# EAGLE design dataBoard (EAGLE 9.4.2)
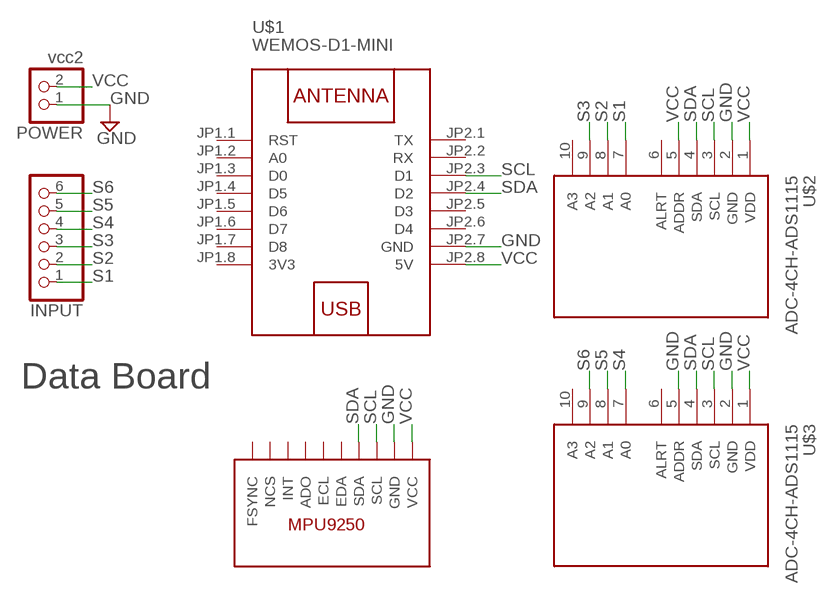
[diagram p0: schematic, sheet 1]

## Parts
INPUT  PINHD-1X6  [1X06]
MPU1  MPU9250  [MPU9250]
POWER  vcc2  PINHD-1X2  [1X02]
U$1  WEMOS-D1-MINI  [WEMOS-D1-MINI]
U$2  ADC-4CH-ADS1115  [ADC-4CH-ADS1115]
U$3  ADC-4CH-ADS1115  [ADC-4CH-ADS1115]

## Nets
GND: MPU1.GND POWER.1 U$1.JP2.7(GND) U$2.2(GND) U$3.2(GND) U$3.5(ADDR)
S1: INPUT.1 U$2.7(A0)
S2: INPUT.2 U$2.8(A1)
S3: INPUT.3 U$2.9(A2)
S4: INPUT.4 U$3.7(A0)
S5: INPUT.5 U$3.8(A1)
S6: INPUT.6 U$3.9(A2)
SCL: MPU1.SCL U$1.JP2.3(D1) U$2.3(SCL) U$3.3(SCL)
SDA: MPU1.SDA U$1.JP2.4(D2) U$2.4(SDA) U$3.4(SDA)
VCC: MPU1.VCC POWER.2 U$1.JP2.8(5V) U$2.1(VDD) U$2.5(ADDR) U$3.1(VDD)
Unconnected: MPU1.ADO MPU1.ECL MPU1.EDA MPU1.FSYNC MPU1.INT MPU1.NCS U$1.JP1.1(RST) U$1.JP1.2(A0) U$1.JP1.3(D0) U$1.JP1.4(D5) U$1.JP1.5(D6) U$1.JP1.6(D7) U$1.JP1.7(D8) U$1.JP2.1(TX) U$1.JP2.2(RX) U$1.JP2.5(D3) U$1.JP2.6(D4) U$2.6(ALRT) U$2.10(A3) U$3.6(ALRT) U$3.10(A3)

## Notes on the sheet
- Data Board

## Power pins joined to a net without a drawn wire
3V3: U$1.JP1.8(3V3)

## Library data of the parts
INPUT = pinhead:PINHD-1X6: PIN HEADER
MPU1 = shoe:MPU9250
POWER = pinhead:PINHD-1X2: PIN HEADER
U$1 = diy-modules:WEMOS-D1-MINI: WEMOS D1 mini: Mini Wi-Fi Board based on ESP-8266 device More details can be found here: https://www.wemos.cc/product/d1-mini.html Click here to find device on ebay.com <http://www.ebay.com/sch/wemos+d1+mini+nodemcu>
U$2 U$3 = diy-modules_me:ADC-4CH-ADS1115: 4 Channel 16-Bit Analog-to-Digital Converter based on ADS1115 chip Arduino ADS1115 Getting Started Tutorial is available here: http://henrysbench.capnfatz.com/henrys-bench/arduino-voltage-measurements/arduino-ads1115-module-getting-started-tutorial/ ADS1115 datasheet is available here: http://www.ti.com/lit/ds/symlink/ads1115.pdf Click here to find device on ebay.com <http://www.ebay.com/sch/ads1115+module>

## Board
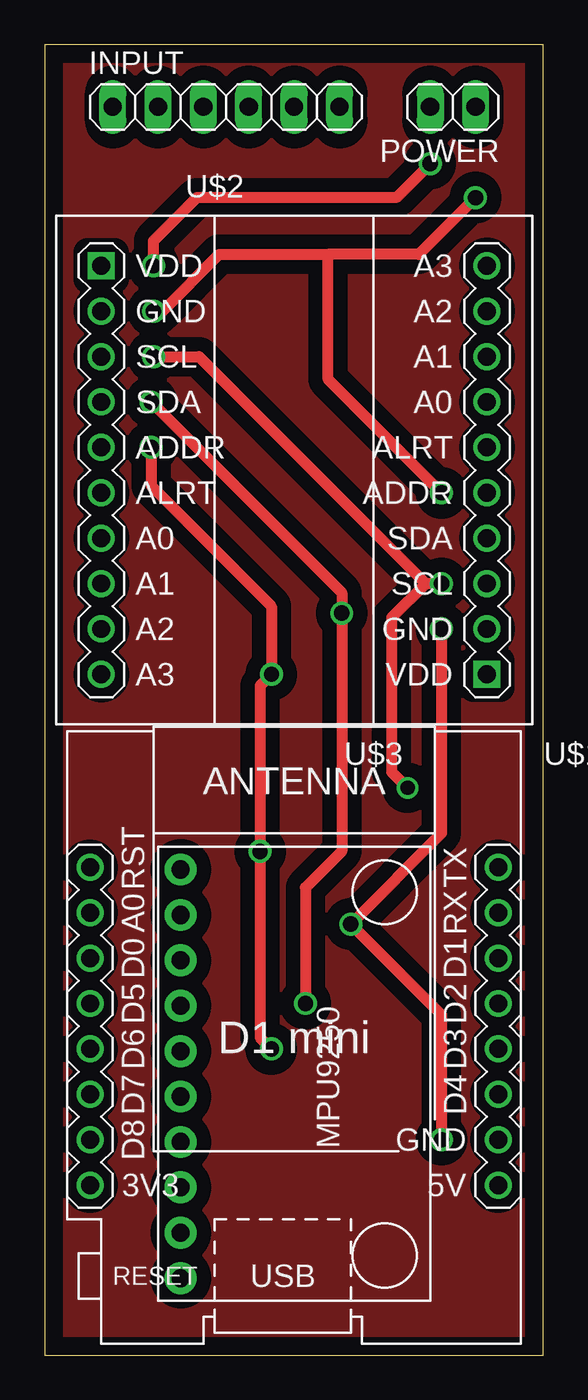
[diagram p1: board, top side]
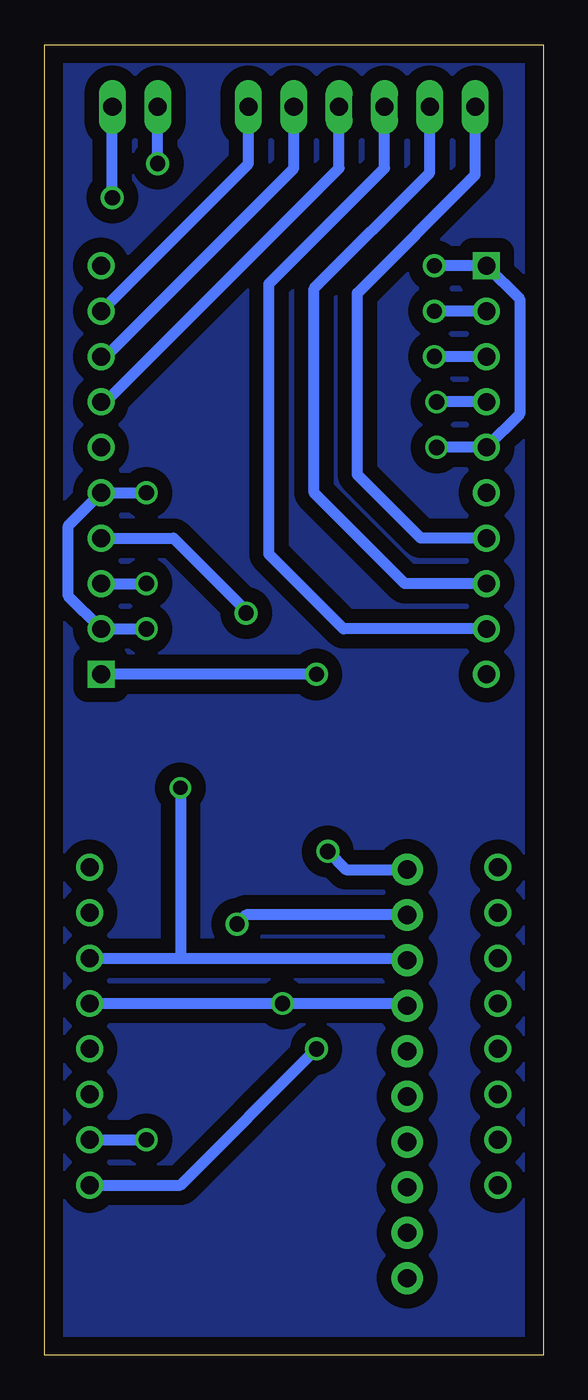
[diagram p2: board, bottom side, seen from below]

Size 27.92 x 73.33 mm. Coordinates in mm from the lower left corner, seen from the top.
Outline: 0,0 27.92,0 27.92,73.33 0,73.33 0,0
Copper layers (1*16): Top 0.035mm / dielectric 1.5mm / Bottom 0.035mm
Design rules "default": minimum track width 6mil, minimum drill 0.35mm, track to track 6mil, track to pad 6mil, pad to pad 6mil, via to via 6mil, smd to smd 6mil, copper to edge 40mil, drill to drill 6mil, minimum pad ring 10mil, minimum via ring 8mil, stop-mask expansion 4mil, vias tented up to drill 0mil, thermal gap 10mil

### Footprints (pad centres in the part's own frame; a part is rotated, then mirrored left to right if it is on the bottom)
1X06 = drill 1.016 long: 1 -6.35,0; 2 -3.81,0; 3 -1.27,0; 4 1.27,0; 5 3.81,0; 6 6.35,0
MPU9250 = drill 1.016 pad 1.778: ADO 3.81,-6.35; ECL 1.27,-6.35; EDA -1.27,-6.35; FSYNC 11.43,-6.35; GND -8.89,-6.35; INT 6.35,-6.35; NCS 8.89,-6.35; SCL -6.35,-6.35; SDA -3.81,-6.35; VCC -11.43,-6.35
1X02 = drill 1.016 long: 1 -1.27,0; 2 1.27,0
WEMOS-D1-MINI = drill 1: JP1.1 -11.43,9.525; JP1.2 -11.43,6.985; JP1.3 -11.43,4.445; JP1.4 -11.43,1.905; JP1.5 -11.43,-0.635; JP1.6 -11.43,-3.175; JP1.7 -11.43,-5.715; JP1.8 -11.43,-8.255; JP2.1 11.43,9.525; JP2.2 11.43,6.985; JP2.3 11.43,4.445; JP2.4 11.43,1.905; JP2.5 11.43,-0.635; JP2.6 11.43,-3.175; JP2.7 11.43,-5.715; JP2.8 11.43,-8.255
ADC-4CH-ADS1115 = drill 1 square: 1 -6.35,11.43 | drill 1: 2 -6.35,8.89; 3 -6.35,6.35; 4 -6.35,3.81; 5 -6.35,1.27; 6 -6.35,-1.27; 7 -6.35,-3.81; 8 -6.35,-6.35; 9 -6.35,-8.89; 10 -6.35,-11.43

### Placement (x,y rotation side)
INPUT  10.16,69.85 0 top
MPU1  13.97,15.75 270 top
POWER  22.86,69.85 180 top
U$1  13.97,17.78 0 top
U$2  9.53,49.53 0 top
U$3  18.41,49.53 180 top

### Tracks (layer width: path | path; a pad name or v marks a point on that pad's centre or on a via)
BOT
  pour Bottom (isolate 0.8): 0,73.28 27.94,73.28 27.94,0 0,0
GND  (via drill 0.85)
  Top 0.61: v22.23,12.06 22.23,19.05 v17.14,24.13 22.23,29.21 v22.23,40.64 | v6.1,58.42 6.6,58.42 9.78,61.59 15.88,61.59 | v24.13,64.77 20.95,61.59 15.88,61.59 | v22.23,48.26 15.88,54.61 15.88,61.59
  Bottom 0.61: U$1.JP2.7 v22.23,12.06 | MPU1.GND 16.64,24.64 v17.14,24.13 | v22.23,40.64 U$3.2 26.6,42.47 26.6,46.43 U$3.5 v22.23,48.26 | U$2.2 v6.1,58.42 | v24.13,64.77 POWER.1
S1
  Bottom 0.61: U$2.7 6.86,45.72 10.41,49.28 10.41,59.44 3.81,66.04 INPUT.1
S2
  Bottom 0.61: U$2.8 7.75,43.18 12.83,48.26 12.83,59.69 6.35,66.17 INPUT.2
S3
  Bottom 0.61: U$2.9 11.18,40.64 15.37,44.83 15.37,59.94 8.89,66.42 INPUT.3
S4
  Bottom 0.61: U$3.7 24.51,53.34 11.43,66.42 INPUT.4
S5
  Bottom 0.61: U$3.8 24.51,55.88 13.97,66.42 INPUT.5
S6
  Bottom 0.61: U$3.9 16.51,66.67 INPUT.6
SCL  (via drill 0.8, 0.85)
  Top 0.61: v22.23,43.18 21.34,43.18 | 21.34,43.18 19.43,41.27 19.43,32.64 v20.32,31.75 | v6.1,55.88 8.64,55.88 21.34,43.18
  Bottom 0.61: U$1.JP2.3 20.32,22.23 | 20.32,22.23 7.75,22.23 MPU1.SCL | U$3.3 v22.23,43.18 | v20.32,31.75 20.32,22.23 | U$2.3 v6.1,55.88
SDA  (via drill 0.85)
  Top 0.61: v14.61,19.68 14.61,26.16 16.64,28.19 v16.64,41.53 16.64,42.67 v5.97,53.34
  Bottom 0.61: U$1.JP2.4 v14.61,19.68 7.75,19.68 MPU1.SDA | U$3.4 20.7,45.72 16.64,41.66 v16.64,41.53 | U$2.4 v5.97,53.34
TOP
  pour Top (isolate 0.8): 0,73.28 27.94,73.28 27.94,0 0,0
VCC  (via drill 0.85)
  Top 0.61: v12.7,17.14 12.06,17.78 v12.06,28.19 12.06,37.47 v12.7,38.1 12.7,41.91 5.97,48.64 v5.97,50.8 | v6.1,60.96 6.1,62.36 8.51,64.77 19.68,64.77 v21.59,66.67
  Bottom 0.61: v12.06,28.19 11.05,27.18 MPU1.VCC | v12.7,17.14 20.32,9.53 U$1.JP2.8 | v12.7,38.1 U$3.1 | v5.97,50.8 U$2.5 1.32,52.65 1.32,59.11 U$2.1 v6.1,60.96 | v21.59,66.67 POWER.2

### Text on the board
bValues: Data Board